# Altium schematic sheet TEBF0808.schdoc: TEBF0808 - Mini-ITX Top Sheet
size A4; DocumentNumber: TEBF0808; Revision: 04; SheetNumber: 1; SheetTotal: 36; Date: 2016-09-29; CompanyName: Trenz Electronic GmbH; Organization: Trenz Electronic GmbH
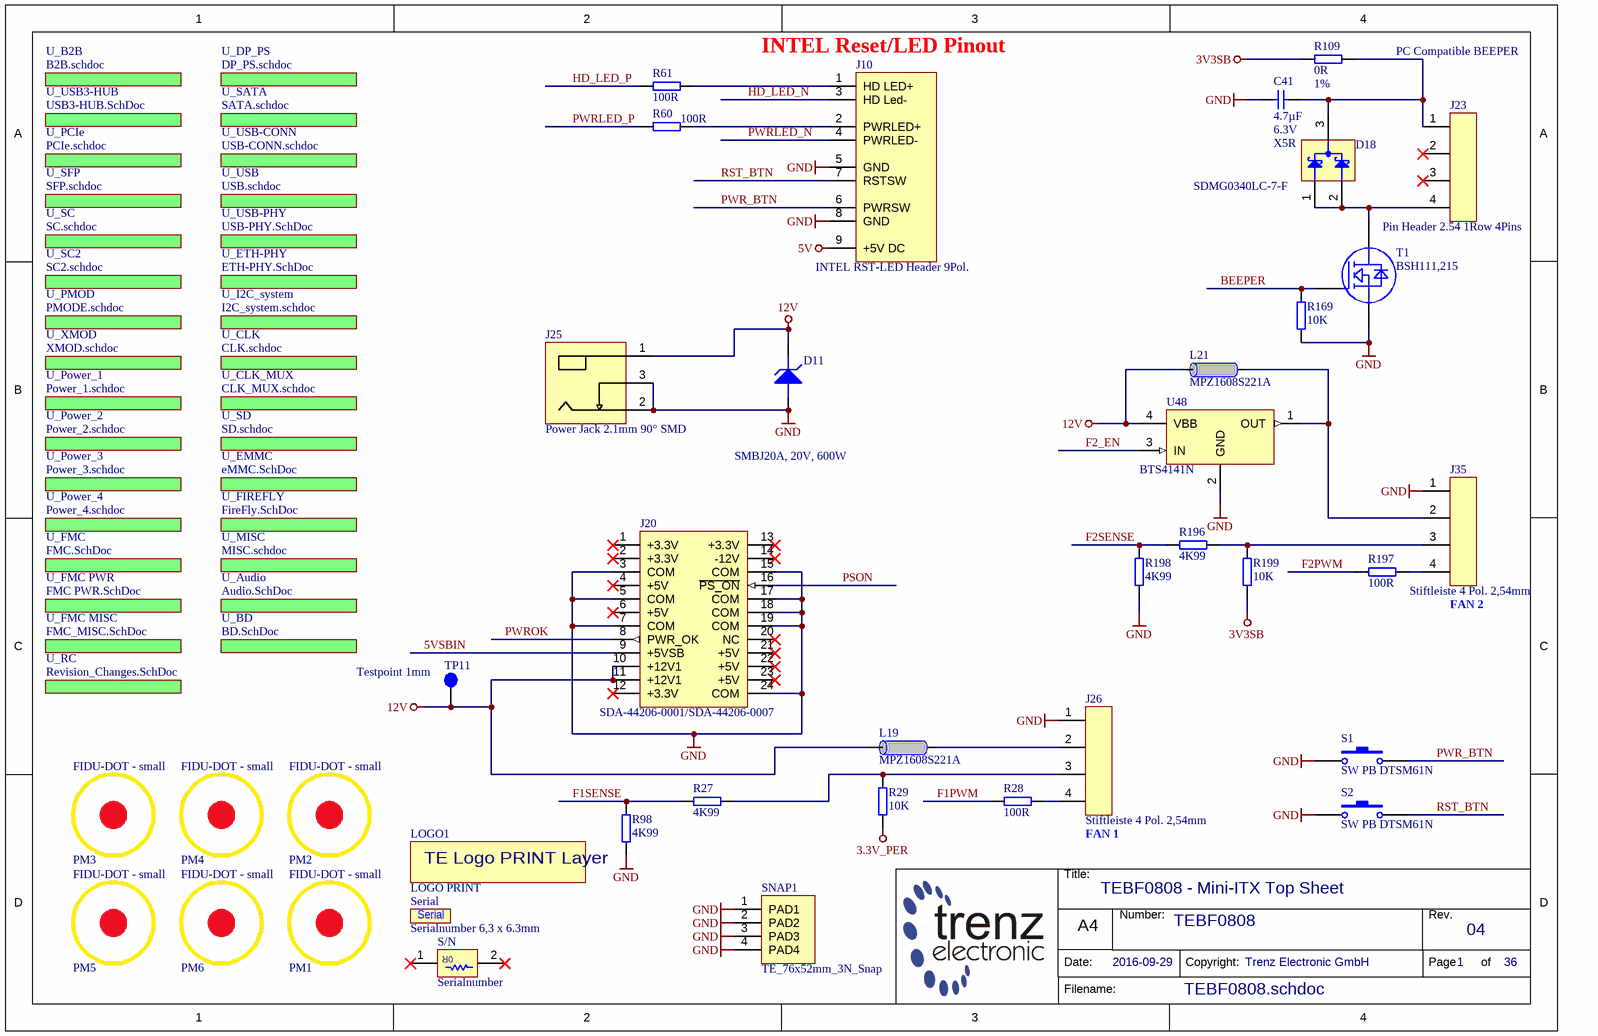
[diagram p0: TEBF0808.schdoc]

## Parts
C41  4.7µF  Voltage: 6.3V  Technology: X5R  [CAPC1005X60N]
D11  SMBJ20A, 20V, 600W  [DIOM5236X261N]
D18  SDMG0340LC-7-F  [SOT65P210X110-3N]
J10  INTEL RST-LED Header 9Pol.  [INTEL_FP_RST_LED_9PIN]
J20  SDA-44206-0001/SDA-44206-0007  [SDA-44206-0001]
J23  Pin Header 2.54 1Row 4Pins  [STIFTLEISTE2_54 OG 1R-4]
J25  Power Jack 2.1mm 90° SMD  [694106106102]
J26  Stiftleiste 4 Pol. 2,54mm  [47053-1000]
J35  Stiftleiste 4 Pol. 2,54mm  [47053-1000]
L19  MPZ1608S221A  [INDC1608X95N]
L21  MPZ1608S221A  [INDC1608X95N]
LOGO1  LOGO PRINT  [LOGO PRINT]  (no BOM)
PM1  FIDU-DOT - small  [FIDU-DOT - small]
PM2  FIDU-DOT - small  [FIDU-DOT - small]
PM3  FIDU-DOT - small  [FIDU-DOT - small]
PM4  FIDU-DOT - small  [FIDU-DOT - small]
PM5  FIDU-DOT - small  [FIDU-DOT - small]
PM6  FIDU-DOT - small  [FIDU-DOT - small]
R27  4K99  [RESC1005X40N]
R28  100R  [RESC1005X40N]
R29  10K  [RESC1005X40N]
R60  100R  [RESC1005X40N]
R61  100R  [RESC1005X40N]
R98  4K99  [RESC1005X40N]
R109  0R  Tolerance: 1%  [RESC1005X40N]
R169  10K  [RESC1005X40N]
R196  4K99  [RESC1005X40N]
R197  100R  [RESC1005X40N]
R198  4K99  [RESC1005X40N]
R199  10K  [RESC1005X40N]
S1  SW PB DTSM61N  [DTSM61N]
S2  SW PB DTSM61N  [DTSM61N]
S/N  Serialnumber  [TraceabilityPad]
Serial  Serialnumber 6,3 x 6.3mm  [Serial_6.3x6.3mm]  (no BOM)
SNAP1  TE_76x52mm_3N_Snap  [TE_76x52mm_Snap]  (no BOM)
T1  BSH111,215  [SOT95P230X109-3N]
TP11  Testpoint 1mm  [TP_1mm]
U48  BTS4141N  [SOT230P700X180-4N]

## Sub-sheets
U_Audio = Audio.SchDoc: no entries
U_B2B = B2B.schdoc: no entries
U_BD = BD.SchDoc: no entries
U_CLK = CLK.schdoc: no entries
U_CLK_MUX = CLK_MUX.schdoc: no entries
U_DP_PS = DP_PS.schdoc: no entries
U_EMMC = eMMC.SchDoc: no entries
U_ETH-PHY = ETH-PHY.SchDoc: no entries
U_FIREFLY = FireFly.SchDoc: no entries
U_FMC = FMC.SchDoc: no entries
U_FMC MISC = FMC_MISC.SchDoc: no entries
U_FMC PWR = FMC PWR.SchDoc: no entries
U_I2C_system = I2C_system.schdoc: no entries
U_MISC = MISC.schdoc: no entries
U_PCIe = PCIe.schdoc: no entries
U_PMOD = PMODE.schdoc: no entries
U_Power_1 = Power_1.schdoc: no entries
U_Power_2 = Power_2.schdoc: no entries
U_Power_3 = Power_3.schdoc: no entries
U_Power_4 = Power_4.schdoc: no entries
U_RC = Revision_Changes.SchDoc: no entries
U_SATA = SATA.schdoc: no entries
U_SC = SC.schdoc: no entries
U_SC2 = SC2.schdoc: no entries
U_SD = SD.schdoc: no entries
U_SFP = SFP.schdoc: no entries
U_USB = USB.schdoc: no entries
U_USB3-HUB = USB3-HUB.SchDoc: no entries
U_USB-CONN = USB-CONN.schdoc: no entries
U_USB-PHY = USB-PHY.SchDoc: no entries
U_XMOD = XMOD.schdoc: no entries

## Nets
3.3V_PER: R29.2
3V3SB: R109.1 R199.2
5V: J10.9(+5V_DC)
12V: D11.1(KATHODE) J20.10(+12V1) J20.11(+12V1) J25.1 L19.2 L21.2 TP11.1 U48.4(VBB)
GND: C41.1 D11.2(ANODE) J10.5(GND) J10.8(GND) J20.3(COM) J20.5(COM) J20.7(COM) J20.15(COM) J20.17(COM) J20.18(COM) J20.19(COM) J20.24(COM) J25.2 J25.3 J26.1 J35.1 R98.2 R169.1 R198.2 S1.1 S2.1 SNAP1.1(PAD1) SNAP1.2(PAD2) SNAP1.3(PAD3) SNAP1.4(PAD4) T1.2(SOURCE) U48.2(GND)
5VSBIN: J20.9(+5VSB)
BEEPER: R169.2 T1.1(GATE)
F1PWM: R28.1
F1SENSE: R27.1 R98.1
F2_EN: U48.3(IN)
F2PWM: R197.1
F2SENSE: R196.1 R198.1
HD_LED_N: J10.3(HD_Led-)
HD_LED_P: R61.1
PSON: J20.16(~{PS_ON})
PWR_BTN: J10.6(PWRSW) S1.2
PWRLED_N: J10.4(PWRLED-)
PWRLED_P: R60.1
PWROK: J20.8(PWR_OK)
RST_BTN: J10.7(RSTSW) S2.2
NetC41_2: C41.2 D18.3(K) J23.1 R109.2
NetD18_1: D18.1(A) D18.2(A) J23.4 T1.3(DRAIN)
NetJ10_1: J10.1(HD_LED+) R61.2
NetJ10_2: J10.2(PWRLED+) R60.2
NetJ26_2: J26.2 L19.1
NetJ26_3: J26.3 R27.2 R29.1
NetJ26_4: J26.4 R28.2
NetJ35_2: J35.2 L21.1 U48.1(OUT)
NetJ35_3: J35.3 R196.2 R199.1
NetJ35_4: J35.4 R197.2

Not connected (* = marked no-connect by the designer): J20 1(+3.3V)* 2(+3.3V)* 4(+5V)* 6(+5V)* 12(+3.3V)* 13(+3.3V)* 14(-12V)* 20(NC)* 21(+5V)* 22(+5V)* 23(+5V)*; J23 2* 3*; S/N 1* 2*

## Notes on the sheet
- (near J10) INTEL Reset/LED Pinout
- PC Compatible BEEPER
- (near J35) FAN 2
- (near J26) FAN 1
- Title:
- Number:
- Rev.
- Date:
- A4
- Copyright:
- Page
- of
- Filename:
- (in symbol 23748) TE Logo PRINT Layer
- (in symbol 27230) 0R

## Library data of the parts
C41 = 24719: KON 4.7µF 6.3V X5R SMD 20%; AN: 24719; Value: 4.7u; Mixed: SMT; Preferred: Yes; Case: 1005 (0402); Tolerance: 20%
D11 = 25534: TVS, Unidirectional, 20V, 600W; AN: 25534; Mixed: SMT; Case: SMB DO-214AA; HelpURL: B:\AD\adlib\datasheet\SMBJ; H-ART: SMBJ20A
D18 = 25051: AN: 25051; Mixed: SMT; Trenz-Stock: Yes; Case: SC70-3 / SOT323; HelpURL: B:\AD\adlib\datasheet\SDMG0340; H-ART: SDMG0340LC-7-F
J10 = 27250: Stiftleiste Intel RST-LED Header 9polig; AN: 27250; Mixed: THT; Trenz-Stock: Yes; HelpURL: B:\AD\adlib\datasheet\INTEL_FP_CON
J20 = 23452: ATX Main Connector 24pol.; AN: 23452; Mixed: THT; Trenz-Stock: Yes; H-ART: 0442060007; Case: MINI-FIT JR. VERTICAL HEADER; HelpURL: B:\AD\adlib\datasheet\ATX-MAIN-24P
J23 = 23162: Stiftleiste gerade 1-reihig, 4pol.; AN: 23162; Mixed: THT; Trenz-Stock: Yes
J25 = 26873: AN: 26873; Mixed: SMT; Trenz-Stock: Yes; HelpURL: B:\ad\adlib\datasheet\694106106102; H-ART: 694106106102
J26 J35 = 24942: Stiftleiste 4 Pol. 7.5mm 2,54mm PC FAN; AN: 24942; Trenz-Stock: Yes; Mixed: THT; HelpURL: B:\AD\adlib\datasheet\47053-1000; H-ART: 47053-1000
L19 L21 = 22718: Ferritdurchführung MPZ1608S221A; AN: 22718; Mixed: SMT; Trenz-Stock: Yes; Value: 220 OHm @ 100MHz; Case: 1608 (0603); HelpURL: B:\AD\adlib\datasheet\MPZ1608; Preferred: Yes; H-ART: MPZ1608S221A
LOGO1 = 23748: AN: 23748
PM1-PM6 = 22905: FIDU-DOT - SMALL 1mm; AN: 22905; Mixed: FIDU
R27 R98 R196 R198 = 22754: WID SMD 4K99 1% 0,063W; AN: 22754; Value: 4.99K; Mixed: SMT; Preferred: Yes; Case: 1005 (0402); Tolerance: 1%; Technology: TK100
R28 R60 R61 R197 = 22507: WID SMD 100R 1% 0,063W; AN: 22507; Mixed: SMT; Value: 100; Preferred: Yes; Case: 1005 (0402); Tolerance: 1%; Technology: TK100
R29 R169 R199 = 22750: WID SMD 10K 1% 0,063W; AN: 22750; Mixed: SMT; Preferred: Yes; Case: 1005 (0402); Value: 10K; Tolerance: 1%; Technology: TK100
R109 = 22738: WID SMD 0R; AN: 22738; Mixed: SMT; Value: 0; Preferred: Yes; Case: 1005 (0402); Technology: TK100
S1 S2 = 22596: Taster Miniatur Leiterplatte 1.6N; AN: 22596; Mixed: SMT; Trenz-Stock: Yes; HelpURL: B:\AD\adlib\datasheet\DTSM; Preferred: Yes; H-ART: DTSM61N
S/N = 27230: AN: 27230; Mixed: SMT; HelpURL: B:\AD\adlib\datasheet\0916580020
Serial = 26753: AN: 26753
SNAP1 = 27115: TE0808 76x52mm Snap; AN: 27115; Mixed: SMT
T1 = 26613: AN: 26613; Mixed: SMT; Trenz-Stock: Yes; Case: SOT23-3; HelpURL: B:\AD\adlib\datasheet\BSH111; Preferred: Yes; H-ART: BSH111,215
TP11 = 25063: AN: 25063; Mixed: SMT
U48 = 27029: AN: 27029; Mixed: SMT; Trenz-Stock: Yes; Case: SOT223-4; HelpURL: B:\AD\adlib\datasheet\BTS4141N; H-ART: BTS4141N